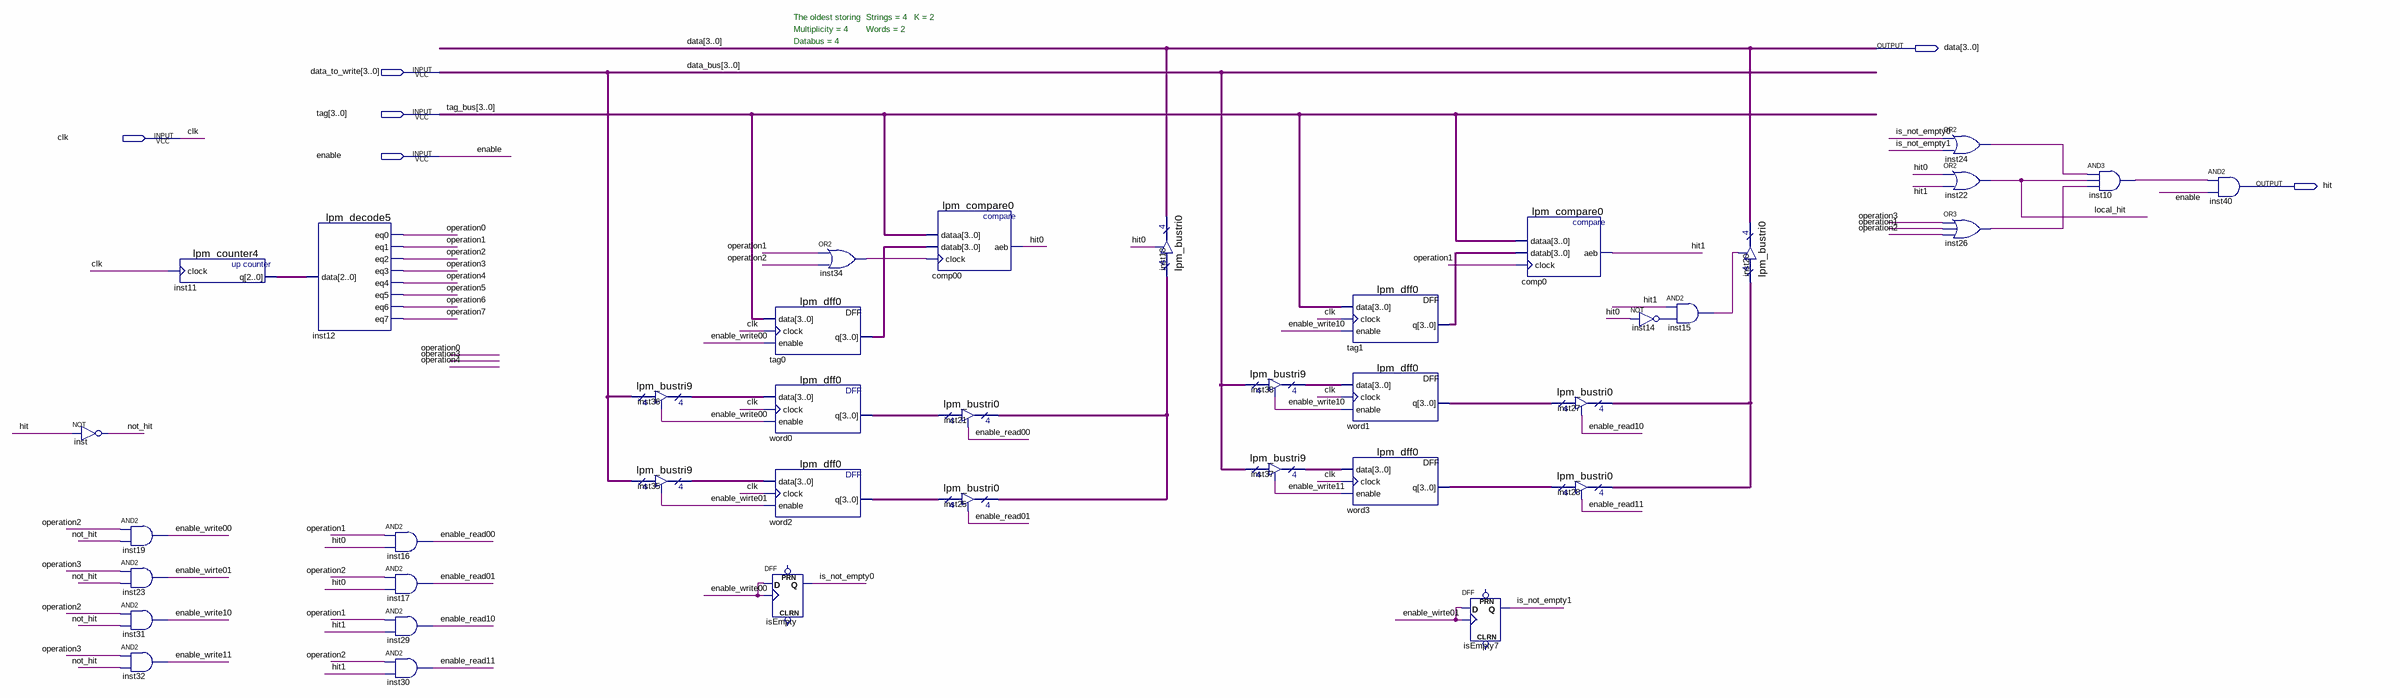
[diagram p0: schematic sheet]
// Quartus schematic cache_block.bdf as structural Verilog: 39 symbols, 6 pins
module cache_block (
  input  [3:0] data_to_write,
  input  [3:0] tag,
  input  clk,
  input  enable,
  output [3:0] data,
  output hit
);

  wire enable_read00, enable_read01, enable_read10, enable_read11, enable_wirte01, enable_write00,
       enable_write10, enable_write11, hit0, hit1, inst10_out, inst14_out, inst15_out, inst24_out,
       inst26_out, inst34_out, is_not_empty0, is_not_empty1, local_hit, not_hit, operation0, operation1,
       operation2, operation3, operation4, operation5, operation6, operation7;
  wire [2:0] inst11_q;
  wire [3:0] inst21_tridata, inst27_tridata, inst35_tridata, inst36_tridata, inst37_tridata, inst38_tridata,
       tag0_q, tag1_q, word0_q, word1_q, word2_q, word3_q;

  not inst (not_hit, hit);
  and inst19 (enable_write00, operation2, not_hit);
  and inst23 (enable_wirte01, operation3, not_hit);
  and inst31 (enable_write10, operation2, not_hit);
  and inst32 (enable_write11, operation3, not_hit);
  lpm_counter4 inst11 (.clock(clk), .q(inst11_q));
  lpm_decode5 inst12 (
    .data(inst11_q), .eq0(operation0), .eq1(operation1), .eq2(operation2), .eq3(operation3),
    .eq4(operation4), .eq5(operation5), .eq6(operation6), .eq7(operation7));
  and inst16 (enable_read00, operation1, hit0);
  and inst17 (enable_read01, operation2, hit0);
  and inst29 (enable_read10, operation1, hit1);
  and inst30 (enable_read11, operation2, hit1);
  lpm_bustri9 inst36 (.enabledt(enable_write00), .data(data_to_write), .tridata(inst36_tridata));
  lpm_bustri9 inst35 (.enabledt(enable_wirte01), .data(data_to_write), .tridata(inst35_tridata));
  lpm_dff0 tag0 (.data(tag), .clock(clk), .enable(enable_write00), .q(tag0_q));
  lpm_dff0 word0 (.data(inst36_tridata), .clock(clk), .enable(enable_write00), .q(word0_q));
  lpm_dff0 word2 (.data(inst35_tridata), .clock(clk), .enable(enable_wirte01), .q(word2_q));
  DFF isEmpty (.CLK(enable_write00), .D(enable_write00), .Q(is_not_empty0));  // open: CLRN, PRN
  or inst34 (inst34_out, operation1, operation2);
  lpm_compare0 comp00 (.dataa(tag), .datab(tag0_q), .clock(inst34_out), .aeb(hit0));
  lpm_bustri0 inst21 (.enabledt(enable_read00), .data(word0_q), .tridata(inst21_tridata));
  lpm_bustri0 inst25 (.enabledt(enable_read01), .data(word2_q), .tridata(inst21_tridata));
  lpm_bustri0 inst18 (.enabledt(hit0), .data(inst21_tridata), .tridata(data));
  lpm_bustri9 inst38 (.enabledt(enable_write10), .data(data_to_write), .tridata(inst38_tridata));
  lpm_bustri9 inst37 (.enabledt(enable_write11), .data(data_to_write), .tridata(inst37_tridata));
  lpm_dff0 tag1 (.data(tag), .clock(clk), .enable(enable_write10), .q(tag1_q));
  lpm_dff0 word1 (.data(inst38_tridata), .clock(clk), .enable(enable_write10), .q(word1_q));
  lpm_dff0 word3 (.data(inst37_tridata), .clock(clk), .enable(enable_write11), .q(word3_q));
  DFF isEmpty7 (.CLK(enable_wirte01), .D(enable_wirte01), .Q(is_not_empty1));  // open: CLRN, PRN
  lpm_compare0 comp0 (.dataa(tag), .datab(tag1_q), .clock(operation1), .aeb(hit1));
  lpm_bustri0 inst27 (.enabledt(enable_read10), .data(word1_q), .tridata(inst27_tridata));
  lpm_bustri0 inst28 (.enabledt(enable_read11), .data(word3_q), .tridata(inst27_tridata));
  not inst14 (inst14_out, hit0);
  and inst15 (inst15_out, hit1, inst14_out);
  lpm_bustri0 inst20 (.enabledt(inst15_out), .data(inst27_tridata), .tridata(data));
  or inst24 (inst24_out, is_not_empty0, is_not_empty1);
  or inst22 (local_hit, hit0, hit1);
  or inst26 (inst26_out, operation3, operation1, operation2);
  and inst10 (inst10_out, inst24_out, local_hit, inst26_out);
  and inst40 (hit, inst10_out, enable);

  // Other names for the same wires on the sheet: data_bus[3:0] = data_to_write; tag_bus[3:0] = tag

  // Notes on the sheet:
  //   The oldest storing
  //   Strings = 4
  //   K = 2
  //   Multiplicity = 4
  //   Words = 2
  //   Databus = 4
endmodule
